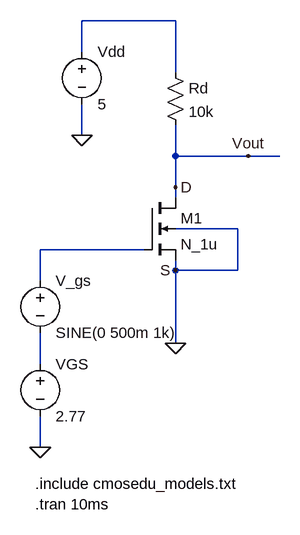
[diagram p0: schematic pequenos sinais.asc]
pequenos sinais.asc, the LTspice schematic file:
Version 4
SHEET 1 880 680
WIRE 272 -352 128 -352
WIRE 128 -304 128 -352
WIRE 272 -272 272 -352
WIRE 128 -176 128 -224
WIRE 272 -144 272 -192
WIRE 384 -144 272 -144
WIRE 432 -144 384 -144
WIRE 272 -96 272 -144
WIRE 272 -80 272 -96
WIRE 368 -32 272 -32
WIRE 224 0 64 0
WIRE 272 32 272 16
WIRE 368 32 368 -32
WIRE 368 32 272 32
WIRE 64 48 64 0
WIRE 272 144 272 32
WIRE 64 176 64 128
WIRE 64 304 64 256
FLAG 64 304 0
FLAG 272 144 0
FLAG 272 32 S
FLAG 128 -176 0
FLAG 272 -96 D
FLAG 384 -144 Vout
SYMBOL voltage 64 160 R0
WINDOW 123 0 0 Left 2
WINDOW 39 0 0 Left 2
SYMATTR InstName VGS
SYMATTR Value 2.77
SYMBOL voltage 64 32 R0
WINDOW 123 0 0 Left 2
WINDOW 39 0 0 Left 2
SYMATTR InstName V_gs
SYMATTR Value SINE(0 500m 1k)
SYMBOL nmos4 224 -80 R0
SYMATTR InstName M1
SYMATTR Value N_1u
SYMATTR Value2 l=1.5u w=3.5u
SYMBOL res 256 -288 R0
SYMATTR InstName Rd
SYMATTR Value 10k
SYMBOL voltage 128 -320 R0
WINDOW 123 0 0 Left 2
WINDOW 39 0 0 Left 2
SYMATTR InstName Vdd
SYMATTR Value 5
TEXT 56 360 Left 2 !.include cmosedu_models.txt
TEXT 56 392 Left 2 !.tran 10ms

The netlist it stands for:
* pequenos sinais.asc
VGS N003 0 2.77
V_gs N002 N003 SINE(0 500m 1k)
M1 Vout N002 0 0 N_1u l=1.5u w=3.5u
Rd N001 Vout 10k
Vdd N001 0 5
.model NMOS NMOS
.model PMOS PMOS
.lib standard.mos
.include cmosedu_models.txt
.tran 10ms
.backanno
.end